# EAGLE design motor_controller-v1.0 (EAGLE 7.6.0)
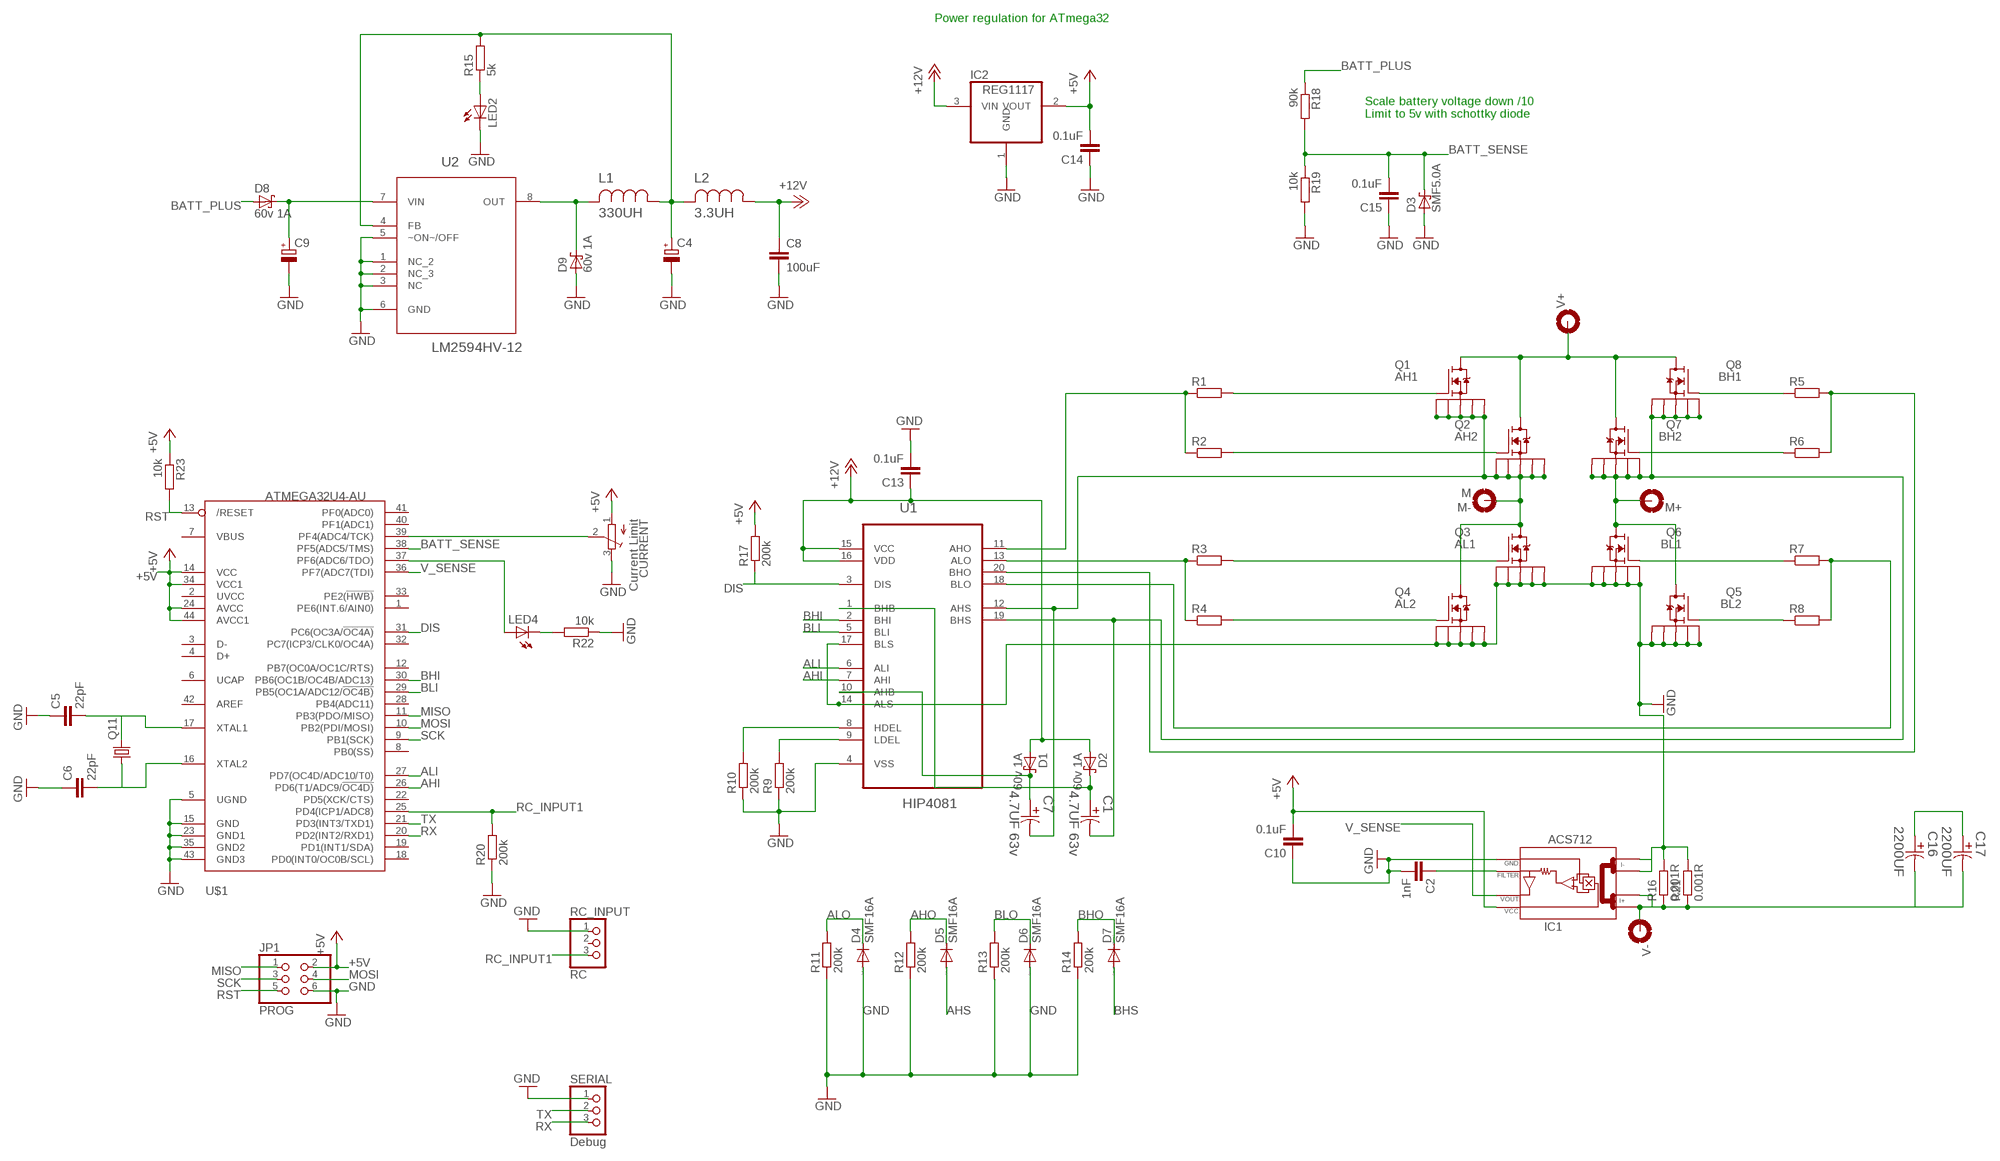
[diagram p0: schematic, sheet 1]

## Parts
C1  4.7UF 63v  EEE-FK1J4R7R-CASE-C  [CAPAE530X610N]
C2  1nF  C-EUC0805  [C0805]
C4  CPOL-EU153CLV-0605  [153CLV-0605]
C5  22pF  C-EUC0805K  [C0805K]
C6  22pF  C-EUC0805K  [C0805K]
C7  4.7UF 63v  EEE-FK1J4R7R-CASE-C  [CAPAE530X610N]
C8  100uF  C-EUC0805  [C0805]
C9  CPOL-EU153CLV-0810  [153CLV-0810]
C10  0.1uF  C-EUC0805  [C0805]
C13  0.1uF  C-EUC0805  [C0805]
C14  0.1uF  C-EUC0805  [C0805]
C15  0.1uF  C-EUC0805  [C0805]
C16  2200UF  ECA1JM222-D18XP7.5  [CAPPR750-1800X4000]
C17  2200UF  ECA1JM222-D18XP7.5  [CAPPR750-1800X4000]
CURRENT  Current Limit  TRIMPOTTC33X  [TC33X]
D1  60v 1A  SMF5.0AT1  [SOD123FL]
D2  60v 1A  SMF5.0AT1  [SOD123FL]
D3  SMF5.0A  SMF5.0AT1  [SOD123FL]
D4  SMF16A  CGRM4001-G  [SOD-123_MINI-SMA]
D5  SMF16A  CGRM4001-G  [SOD-123_MINI-SMA]
D6  SMF16A  CGRM4001-G  [SOD-123_MINI-SMA]
D7  SMF16A  CGRM4001-G  [SOD-123_MINI-SMA]
D8  60v 1A  SMF5.0AT1  [SOD123FL]
D9  60v 1A  SMF5.0AT1  [SOD123FL]
IC1  ACS712  [SO08]
IC2  REG1117  [SOT223]
JP1  PROG  PINHD-2X3  [2X03]
L1  330UH  ELLCTV331M-CTV  [IND_ELLCTV]
L2  3.3UH  ELL3FU3R3N-3FU  [IND_ELL3FU]
LED2  LEDCHIPLED_1206  [CHIPLED_1206]
LED4  LEDCHIPLED_1206  [CHIPLED_1206]
M+  MOUNT-PAD-ROUND3.2  [3,2-PAD]
M-  M  MOUNT-PAD-ROUND3.2  [3,2-PAD]
Q1  AH1  NMOSFET-D2PAK-7  [D2PAK-7]
Q2  AH2  NMOSFET-D2PAK-7  [D2PAK-7]
Q3  AL1  NMOSFET-D2PAK-7  [D2PAK-7]
Q4  AL2  NMOSFET-D2PAK-7  [D2PAK-7]
Q5  BL2  NMOSFET-D2PAK-7  [D2PAK-7]
Q6  BL1  NMOSFET-D2PAK-7  [D2PAK-7]
Q7  BH2  NMOSFET-D2PAK-7  [D2PAK-7]
Q8  BH1  NMOSFET-D2PAK-7  [D2PAK-7]
Q11  CRYSTALQC5CB  [QC5CB-XTAL]
R1  R-EU_M0805  [M0805]
R2  R-EU_M0805  [M0805]
R3  R-EU_M0805  [M0805]
R4  R-EU_M0805  [M0805]
R5  R-EU_M0805  [M0805]
R6  R-EU_M0805  [M0805]
R7  R-EU_M0805  [M0805]
R8  R-EU_M0805  [M0805]
R9  200k  R-EU_M0805  [M0805]
R10  200k  R-EU_M0805  [M0805]
R11  200k  R-EU_M0805  [M0805]
R12  200k  R-EU_M0805  [M0805]
R13  200k  R-EU_M0805  [M0805]
R14  200k  R-EU_M0805  [M0805]
R15  5k  R-EU_M0805  [M0805]
R16  0.001R  R-EU_R2512  [R2512]
R17  200k  R-EU_M0805  [M0805]
R18  90k  R-EU_M0805  [M0805]
R19  10k  R-EU_M0805  [M0805]
R20  200k  R-EU_M0805  [M0805]
R21  0.001R  R-EU_R2512  [R2512]
R22  10k  R-EU_M0805  [M0805]
R23  10k  R-EU_M0805  [M0805]
RC_INPUT  RC  PINHD-1X3  [1X03]
SERIAL  Debug  PINHD-1X3  [1X03]
U1  HIP4081  HIP4081AIBZ  [SOIC127P1032X265-20N]
U2  LM2594HV-12  LM2594M-12  [SOIC127P620X175-8N]
U$1  ATMEGA32U4-AU  [TQFP44]
V+  MOUNT-PAD-ROUND3.2  [3,2-PAD]
V-  MOUNT-PAD-ROUND3.2  [3,2-PAD]

## Nets
+5V: C10.2 C14.2 CURRENT.1(A) IC1.8(VCC) IC2.2(VOUT) JP1.2 R17.2 R23.1 U$1.14(VCC) U$1.24(AVCC) U$1.34(VCC1) U$1.44(AVCC1)
+12V: C8.1 C13.1 D1.A D2.A IC2.3(VIN) L2.1 U1.15(VCC) U1.16(VDD)
AHI: U1.7(AHI) U$1.26(PD6(T1/ADC9/!OC4D))
AHO: D5.C R1.1 R2.1 R12.2 U1.11(AHO)
AHS: C7.2 D5.A M-.B3,2(MOUNT) Q1.S1 Q1.S2 Q1.S3 Q1.S4 Q1.S5 Q2.S1 Q2.S2 Q2.S3 Q2.S4 Q2.S5 Q3.D Q4.D U1.12(AHS)
ALI: U1.6(ALI) U$1.27(PD7(OC4D/ADC10/T0))
ALO: D4.C R3.1 R4.1 R11.2 U1.13(ALO)
BATT_GND: C16.2 C17.2 IC1.1(I+_0) IC1.2(I+_1) R16.1 R21.1 V-.B3,2(MOUNT)
BATT_PLUS: C16.1 C17.1 D8.A Q1.D Q2.D Q7.D Q8.D R18.1 V+.B3,2(MOUNT)
BATT_SENSE: C15.2 D3.C R18.2 R19.1 U$1.38(PF5(ADC5/TMS))
BHI: U1.2(BHI) U$1.30(PB6(OC1B/OC4B/ADC13))
BHO: D7.C R5.2 R6.2 R14.2 U1.20(BHO)
BHS: C1.2 D7.A M+.B3,2(MOUNT) Q5.D Q6.D Q7.S1 Q7.S2 Q7.S3 Q7.S4 Q7.S5 Q8.S1 Q8.S2 Q8.S3 Q8.S4 Q8.S5 U1.19(BHS)
BLI: U1.5(BLI) U$1.29(PB5(OC1A/ADC12/!OC4B))
BLO: D6.C R7.2 R8.2 R13.2 U1.18(BLO)
DIS: R17.1 U1.3(DIS) U$1.31(PC6(OC3A/!OC4A))
GND: C2.2 C4.- C5.1 C6.1 C8.2 C9.- C10.1 C13.2 C14.1 C15.1 CURRENT.3(E) D3.A D4.A D6.A D9.A IC1.3(I-_0) IC1.4(I-_1) IC1.5(GND) IC2.1(GND) JP1.6 LED2.C Q3.S1 Q3.S2 Q3.S3 Q3.S4 Q3.S5 Q4.S1 Q4.S2 Q4.S3 Q4.S4 Q4.S5 Q5.S1 Q5.S2 Q5.S3 Q5.S4 Q5.S5 Q6.S1 Q6.S2 Q6.S3 Q6.S4 Q6.S5 R9.1 R10.1 R11.1 R12.1 R13.1 R14.1 R16.2 R19.2 R20.1 R21.2 R22.1 RC_INPUT.1 SERIAL.1 U1.4(VSS) U1.14(ALS) U1.17(BLS) U2.1(NC_2) U2.2(NC_3) U2.3(NC) U2.5(~ON~/OFF) U2.6(GND) U$1.5(UGND) U$1.15(GND) U$1.23(GND1) U$1.35(GND2) U$1.43(GND3)
MISO: JP1.1 U$1.11(PB3(PDO/MISO))
MOSI: JP1.4 U$1.10(PB2(PDI/MOSI))
N$1: C9.+ D8.C U2.7(VIN)
N$2: C4.+ L1.1 L2.2 R15.2 U2.4(FB)
N$3: Q1.G R1.2
N$4: C2.1 IC1.6(FILTER)
N$5: Q2.G R2.2
N$6: LED4.A U$1.37(PF6(ADC6/TDO))
N$7: Q3.G R3.2
N$8: Q4.G R4.2
N$9: LED2.A R15.1
N$10: D9.C L1.2 U2.8(OUT)
N$11: Q8.G R5.1
N$12: Q7.G R6.1
N$13: Q6.G R7.1
N$14: Q5.G R8.1
N$15: C6.2 Q11.1 U$1.16(XTAL2)
N$16: C5.2 Q11.2 U$1.17(XTAL1)
N$17: CURRENT.2(S) U$1.39(PF4(ADC4/TCK))
N$18: LED4.C R22.2
N$37: R9.2 U1.9(LDEL)
N$38: R10.2 U1.8(HDEL)
N$42: C7.1 D1.C U1.10(AHB)
N$43: C1.1 D2.C U1.1(BHB)
RC_INPUT1: R20.2 RC_INPUT.3 U$1.25(PD4(ICP1/ADC8))
RST: JP1.5 R23.2 U$1.13(/RESET)
RX: SERIAL.3 U$1.20(PD2(INT2/RXD1))
SCK: JP1.3 U$1.9(PB1(SCK))
TX: SERIAL.2 U$1.21(PD3(INT3/TXD1))
V_SENSE: IC1.7(VOUT) U$1.36(PF7(ADC7(TDI))
Unconnected: RC_INPUT.2 U$1.1(PE6(INT.6/AIN0)) U$1.2(UVCC) U$1.3(D-) U$1.4(D+) U$1.6(UCAP) U$1.7(VBUS) U$1.8(PB0(SS)) U$1.12(PB7(OC0A/OC1C/RTS)) U$1.18(PD0(INT0/OC0B/SCL)) U$1.19(PD1(INT1/SDA)) U$1.22(PD5(XCK/CTS)) U$1.28(PB4(ADC11)) U$1.32(PC7(ICP3/CLK0/OC4A)) U$1.33(PE2(!HWB)) U$1.40(PF1(ADC1)) U$1.41(PF0(ADC0)) U$1.42(AREF)

## Notes on the sheet
- Power regulation for ATmega32
- Scale battery voltage down /10
  Limit to 5v with schottky diode

## Library data of the parts
C1 C7 = Panasonic-EEEFK_EEEFP:EEE-: Aluminum Electrolytic Capacitors,Surface Mount Type; MPN: EEE-FK1J4R7R; OC_FARNELL: 9695990; OC_NEWARK: 96K9402; PACKAGE: CASE-C; SUPPLIER: PANASONIC; TOLERANCE: ±20 %; VALUE: 4.7UF; VOLTAGERATING: 63V
C2 C5 C6 C8 C10 C13-C15 = rcl:C-EU: CAPACITOR, European symbol
C4 C9 = rcl:CPOL-EU: POLARIZED CAPACITOR, European symbol
C16 C17 = Panasonic-ECA_00:ECA: Aluminum Electrolytic Capacitors/Radial Lead Type/Series: M/Type: A; MPN: ECA1JM222; OC_FARNELL: 1848515; OC_NEWARK: 17T5022; PACKAGE: Radial Lead-TH; SUPPLIER: PANASONIC; TOLERANCE: ±20 %; VOLTAGERATING: 63V
CURRENT = adafruit:TRIMPOT: SMT trimmer potentiometer part number TC33X http://www.ladyada.net/library/eagle
D1-D3 D8 D9 = diode:SMF5.0AT1: 200 W Transient Voltage Suppressor Source: Data sheet <http://www.onsemi.com/pub_link/Collateral/SMF5.0AT1-D.PDF>
D4-D7 = diode:CGRM400*-G: Molded plasitc,JEDEC SOD-123/Mini SMA Source: Comchip CGRM4001-G.pdf
IC1 = ACS712:ACS712
IC2 = burr-brown:REG1117: 800mA and 1A Low Dropout (LDO) Positive Regulator 1.8V, 2.5V, 2.85V, 3.3V, 5V, and Adj; MPN: REG1117; OC_FARNELL: 1097566; OC_NEWARK: 14P6981
JP1 = pinhead:PINHD-2X3: PIN HEADER
L1 = Panasonic-ELL:ELL: Choke Coils; MPN: ELLCTV331M; OC_FARNELL: 1717539; OC_NEWARK: 15R1008; PACKAGE: 12X12X4.5MM; SUPPLIER: PANASONIC
L2 = Panasonic-ELL:ELL: Choke Coils; CURRENTRATING: 1.16A; MPN: ELL3FU3R3N; OC_FARNELL: 1888689; OC_NEWARK: unknown; PACKAGE: SMD-3FU; SUPPLIER: PANASONIC; TOLERANCE: ±30 %
LED2 LED4 = led:LED: LED OSRAM: - CHIPLED LG R971, LG N971, LY N971, LG Q971, LY Q971, LO R971, LY R971 LH N974, LH R974 LS Q976, LO Q976, LY Q976 LO Q996 - Hyper CHIPLED LW Q18S LB Q993, LB Q99A, LB R99A - SideLED LS A670, LO A670, LY A670, LG A670, LP A670 LB A673, LV A673, LT A673, LW A673 LH A674 LY A675 LS A676, LA A676, LO A676, LY A676, LW A676 LS A679, LY A679, LG A679 - Hyper Micro SIDELED® LS Y876, LA Y876, LO Y876, LY Y876 LT Y87S - SmartLED LW L88C, LW L88S LB L89C, LB L89S, LG L890 LS L89K, LO L89K, LY L89K LS L896, LA L896, LO L896, LY L896 - TOPLED LS T670, LO T670, LY T670, LG T670, LP T670 LSG T670, LSP T670, LSY T670, LOP T670, LYG T670 LG T671, LOG T671, LSG T671 LB T673, LV T673, LT T673, LW T673 LH T674 LS T676, LA T676, LO T676, LY T676, LB T676, LH T676, LSB T676, LW T676 LB T67C, LV T67C, LT T67C, LS T67K, LO T67K, LY T67K, LW E67C LS E67B, LA E67B, LO E67B, LY E67B, LB E67C, LV E67C, LT E67C LW T67C LS T679, LY T679, LG T679 LS T770, LO T770, LY T770, LG T770, LP T770 LB T773, LV T773, LT T773, LW T773 LH T774 LS E675, LA E675, LY E675, LS T675 LS T776, LA T776, LO T776, LY T776, LB T776 LHGB T686 LT T68C, LB T68C - Hyper Mini TOPLED® LB M676 - Mini TOPLED Santana® LG M470 LS M47K, LO M47K, LY M47K Source: http://www.osram.convergy.de LUXEON: - LUMILED® LXK2-PW12-R00, LXK2-PW12-S00, LXK2-PW14-U00, LXK2-PW14-V00 LXK2-PM12-R00, LXK2-PM12-S00, LXK2-PM14-U00 LXK2-PE12-Q00, LXK2-PE12-R00, LXK2-PE12-S00, LXK2-PE14-T00, LXK2-PE14-U00 LXK2-PB12-K00, LXK2-PB12-L00, LXK2-PB12-M00, LXK2-PB14-N00, LXK2-PB14-P00, LXK2-PB14-Q00 LXK2-PR12-L00, LXK2-PR12-M00, LXK2-PR14-Q00, LXK2-PR14-R00 LXK2-PD12-Q00, LXK2-PD12-R00, LXK2-PD12-S00 LXK2-PH12-R00, LXK2-PH12-S00 LXK2-PL12-P00, LXK2-PL12-Q00, LXK2-PL12-R00 Source: www.luxeon.com KINGBRIGHT: KA-3528ASYC Source: www.kingbright.com
M+ M- V+ V- = holes:MOUNT-PAD-ROUND: MOUNTING PAD, round
Q1-Q8 = D2PAK-7:NMOSFET-D2PAK-7
Q11 = andys_parts:CRYSTAL: CRYSTAL
R1-R23 = rcl:R-EU_: RESISTOR, European symbol
RC_INPUT SERIAL = pinhead:PINHD-1X3: PIN HEADER
U1 = Intersil_By_element14_Batch_1:HIP4081AIBZ: 80V/2.5A Peak, High Frequency Full Bridge FET Driver; MPN: HIP4081AIBZ; OC_FARNELL: 1561934; OC_NEWARK: 57K3816; PACKAGE: SOIC-20; SUPPLIER: Intersil
U2 = andys_parts:LM2594M-12: SIMPLE SWITCHER; MPN: LM2594M-12; OC_FARNELL: 1850240; OC_NEWARK: 41K3820; PACKAGE: SOIC-8; SUPPLIER: National Semiconductor
U$1 = adafruit:ATMEGA32U4: http://www.ladyada.net/library/eagle

## Board
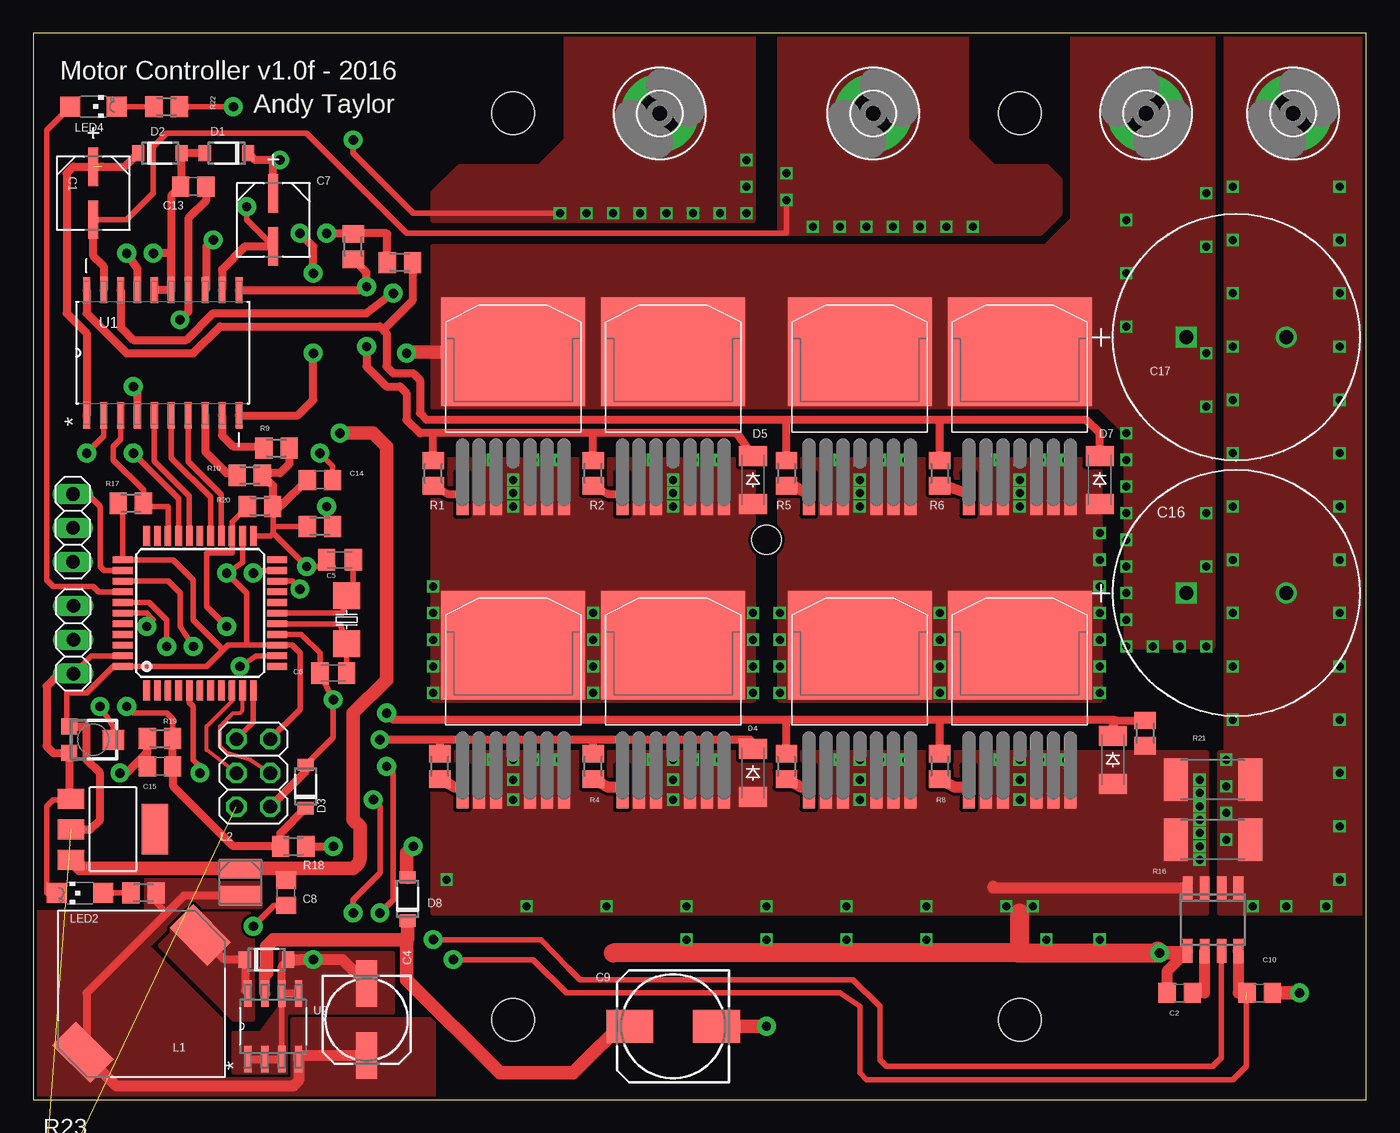
[diagram p1: board, top side]
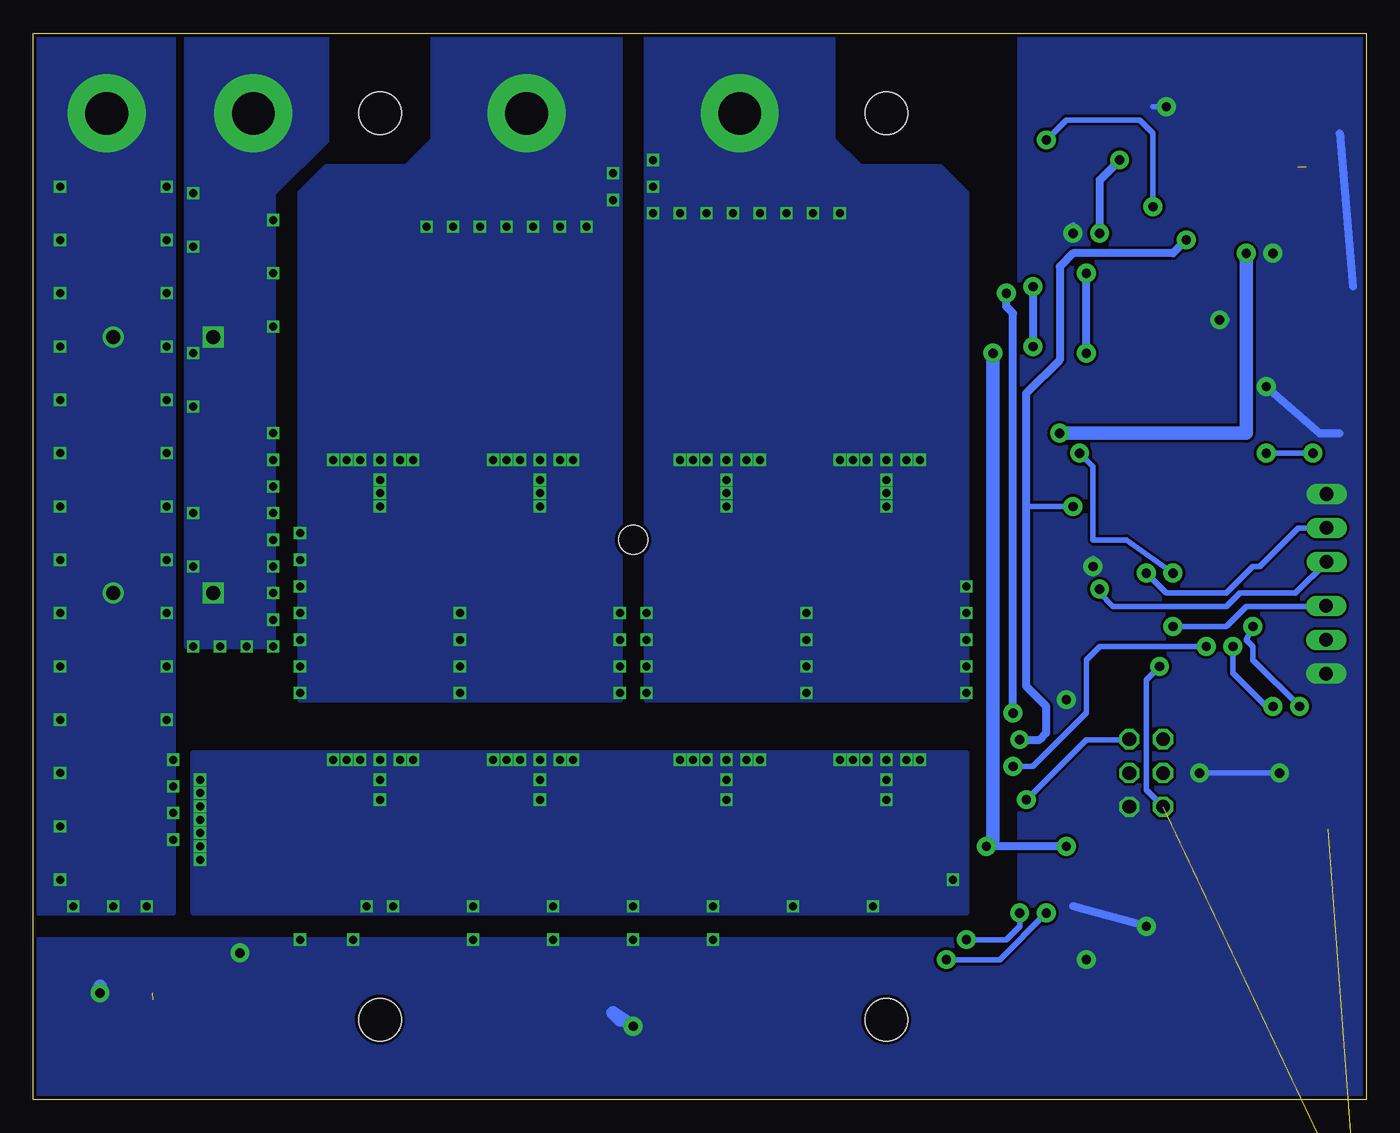
[diagram p2: board, bottom side, seen from below]

Size 100 x 80 mm. Coordinates in mm from the lower left corner, seen from the top.
Outline: 0,0 100,0 100,80 0,80 0,0
Copper layers (1*16): Top 0.035mm / dielectric 1.5mm / Bottom 0.035mm
Design rules "dirt_cheap_dirty_boards.v1 *": minimum track width 5mil, minimum drill 12mil, track to track 8mil, track to pad 8mil, pad to pad 8mil, via to via 8mil, smd to smd 0mil, copper to edge 10mil, drill to drill 10mil, minimum pad ring 10mil, minimum via ring 6mil, stop-mask expansion 2mil, vias tented up to drill 25mil, thermal gap 10mil
Holes 3.2 mm at 74,74 74,6 36,74 36,6
Holes 2.2 mm at 55,42

### Footprints (pad centres in the part's own frame; a part is rotated, then mirrored left to right if it is on the bottom)
CAPAE530X610N = smd 2.87 x 0.762: 1 -1.981,0; 2 1.981,0
C0805 = smd 1.3 x 1.5: 1 -0.95,0; 2 0.95,0
153CLV-0605 = smd 3.5 x 1.6: + 2.7,0; - -2.7,0
C0805K = smd 1.3 x 1.6: 1 -1,0; 2 1,0
153CLV-0810 = smd 3.5 x 2.5: + 3.25,0; - -3.25,0
CAPPR750-1800X4000 = drill 1.041 square: 1 -7.493,0 | drill 1.041: 2 0,0
TC33X = smd 1.2 x 1.2: 1 -1,-1.825; 3 1,-1.825 | smd 1.5 x 1.6: 2 0,1.5
SOD123FL = smd 0.91 x 1.22: A 1.625,0; C -1.625,0
SOD-123_MINI-SMA = smd 1.5 x 2.1: A 1.8,0; C -1.8,0
SO08 = smd 0.72 x 1.78: 1 -1.905,-2.35; 2 -0.635,-2.35; 3 0.635,-2.35; 4 1.905,-2.35; 5 1.905,2.35; 6 0.635,2.35; 7 -0.635,2.35; 8 -1.905,2.35
SOT223 = smd 1.499 x 2.007: 1 -2.261,-3.15; 2 0.025,-3.15; 3 2.311,-3.15 | smd 3.81 x 2.007: 4 0,3.15
2X03 = drill 1.016 octagon: 1 -2.54,-1.27; 2 -2.54,1.27; 3 0,-1.27; 4 0,1.27; 5 2.54,-1.27; 6 2.54,1.27
IND_ELLCTV = smd 2.5 x 4 rotated 45: 1 -4.4,-4.4; 2 4.4,4.4
IND_ELL3FU = smd 1.448 x 3.2: 1 -1.016,0; 2 1.016,0
CHIPLED_1206 = smd 1.5 x 1.5: A 0,-1.75; C 0,1.75
3,2-PAD = drill 3.2 pad 5.842: B3,2 0,0
D2PAK-7 = smd 10.8 x 8.15: D 0,4.1 | smd 0.9 x 3.2: G -3.81,-6.56; S1 -2.54,-6.56; S2 -1.27,-6.56; S3 1.27,-6.56; S4 2.54,-6.56; S5 3.81,-6.56
QC5CB-XTAL = smd 2 x 2: 1 -1.8,0; 2 1.8,0
M0805 = smd 1.3 x 1.6: 1 -0.95,0; 2 0.95,0
R2512 = smd 1.8 x 3.2: 1 -2.8,0; 2 2.8,0
1X03 = drill 1.016 long: 1 -2.54,0; 2 0,0; 3 2.54,0
SOIC127P1032X265-20N = smd 1.981 x 0.533: 1 -4.699,5.715; 2 -4.699,4.445; 3 -4.699,3.175; 4 -4.699,1.905; 5 -4.699,0.635; 6 -4.699,-0.635; 7 -4.699,-1.905; 8 -4.699,-3.175; 9 -4.699,-4.445; 10 -4.699,-5.715; 11 4.699,-5.715; 12 4.699,-4.445; 13 4.699,-3.175; 14 4.699,-1.905; 15 4.699,-0.635; 16 4.699,0.635; 17 4.699,1.905; 18 4.699,3.175; 19 4.699,4.445; 20 4.699,5.715
SOIC127P620X175-8N = smd 1.981 x 0.559: 1 -2.464,1.905; 2 -2.464,0.635; 3 -2.464,-0.635; 4 -2.464,-1.905; 5 2.464,-1.905; 6 2.464,-0.635; 7 2.464,0.635; 8 2.464,1.905
TQFP44 = smd 1.5 x 0.5: 1 -5.8,4; 2 -5.8,3.2; 3 -5.8,2.4; 4 -5.8,1.6; 5 -5.8,0.8; 6 -5.8,0; 7 -5.8,-0.8; 8 -5.8,-1.6; 9 -5.8,-2.4; 10 -5.8,-3.2; 11 -5.8,-4; 23 5.8,-4; 24 5.8,-3.2; 25 5.8,-2.4; 26 5.8,-1.6; 27 5.8,-0.8; 28 5.8,0; 29 5.8,0.8; 30 5.8,1.6; 31 5.8,2.4; 32 5.8,3.2; 33 5.8,4 | smd 0.5 x 1.5: 12 -4,-5.8; 13 -3.2,-5.8; 14 -2.4,-5.8; 15 -1.6,-5.8; 16 -0.8,-5.8; 17 0,-5.8; 18 0.8,-5.8; 19 1.6,-5.8; 20 2.4,-5.8; 21 3.2,-5.8; 22 4,-5.8; 34 4,5.8; 35 3.2,5.8; 36 2.4,5.8; 37 1.6,5.8; 38 0.8,5.8; 39 0,5.8; 40 -0.8,5.8; 41 -1.6,5.8; 42 -2.4,5.8; 43 -3.2,5.8; 44 -4,5.8

### Placement (x,y rotation side)
C1  4.5,68 270 top
C2  86,8 180 top
C4  25,6 270 top
C5  23,40.5 0 top
C6  22.5,32 0 top
C7  18,66 270 top
C8  18.96,15.52 270 top
C9  48,5.5 180 top
C10  92,8 180 top
C13  12,68.5 0 top
C14  21.5,46.5 0 top
C15  9.5,25 0 top
C16  94,38 0 top
C17  94,57.2 0 top
CURRENT  4.5,27 270 top
D1  14.5,71 180 top
D2  9.5,71 0 top
D3  20.43,23.49 90 top
D4  54,24.5 270 top
D5  54,46.5 270 top
D6  81,25.5 270 top
D7  80,46.5 270 top
D8  28.07,15.05 90 top
D9  17.5,10.5 0 top
IC1  88.5,13.5 180 top
IC2  5.98,20.28 270 top
JP1  16.5,24.5 270 top
L1  8.12,7.94 0 top
L2  15.54,16.31 270 top
LED2  3.5,15.5 90 top
LED4  4.5,74.5 270 top
M+  63,74 0 top
M-  47,74 0 top
Q1  36,52 0 top
Q2  48,52 0 top
Q3  36,30 0 top
Q4  48,30 0 top
Q5  74,30 0 top
Q6  62,30 0 top
Q7  74,52 0 top
Q8  62,52 0 top
Q11  23.5,36 90 top
R1  30,47 270 top
R2  42,47 270 top
R3  30.5,25 270 top
R4  42,25 270 top
R5  56.5,47 90 top
R6  68,47 90 top
R7  56.5,25 90 top
R8  68,25 90 top
R9  18.25,48.88 180 top
R10  16.25,46.84 180 top
R11  21.5,43 0 top
R12  24,64 270 top
R13  83.4,27.5 90 top
R14  27.5,62.8 0 top
R15  8.27,15.51 0 top
R16  88.5,19.5 180 top
R17  7.32,44.75 180 top
R18  19.5,19 180 top
R19  9.5,27.1 180 top
R20  17,44.5 180 top
R21  88.5,24 180 top
R22  10,74.5 180 top
R23  2,-4 0 top  (outside the outline)
RC_INPUT  3,34.5 90 top
SERIAL  2.96,42.89 270 top
U1  9.72,56.03 90 top
U2  18,5.5 90 top
U$1  12.5,36.5 90 top
V+  83.5,74 90 top
V-  94.5,74 0 top

### Tracks (layer width: path | path; a pad name or v marks a point on that pad's centre or on a via)
+5V  (via drill 0.7 pad 1.42)  (2 unrouted)
  Top 0.406: 4,28 3.5,28 | R17.2 6.7,44.42 U$1.34 10.5,40.5 12,39 12,36 14.25,33.75 | JP1.2 20,29.27 20,33.5 19.4,34.1 U$1.14 16,34.1 | v24,14 24,15 26,17 26,22 v25.5,22.5 | v31.5,10.5 34,10.5 37.5,10.5 40,8 41.5,8 60.5,8 62,7 62,2 62.5,1.5 90,1.5 91,2.5 91,7.5 | 14.25,33.75 13,32.5 U$1.44 6,32.5 4,30.5 2.5,30.5 2.5,28 CURRENT.1 | 14.25,33.75 14.6,34.1 16,34.1 | C14.2 22.45,47.55 v21.5,48.5 | U$1.24 15.7,40.3 v14.5,39.5 16,38 16,34.1
  Top 0.61: IC2.2 4.26,20.26 5,21 5,24.5 4,25.5 4,28 CURRENT.1
  Top 0.813: IC1.8 90.41,8 C10.2
  Bottom 0.406: v31.5,10.5 27.5,10.5 v24,14 | v25.5,22.5 21,27 17.81,27 JP1.2 | v21.5,48.5 20.5,47.5 20.5,42 18,42 v14.5,39.5
+12V  (via drill 0.7 pad 1.42)
  Top 0.61: U1.15 U1.16 | D1.A D2.A 11.12,68.58 C13.1 10.36,67.81 U1.15 | U1.15 10.36,63.5 v9,63.5
  Top 1.016: IC2.3 3.47,17.33 L2.1 19,17.33 | 19,17.33 24,17.33 24.31,17.64 arc45 24.5,18.09 24.5,20.5 24,21 24,29 26.5,31.5 26.5,49 25.5,50 v23,50 | C8.1 19,16.47 19,17.33
  Bottom 1.016: v9,63.5 9,50 v23,50
AHI
  Top 0.406: U$1.26 14.1,45.4 11.62,47.88 U1.7
AHO  (via drill 0.7 pad 1.42)
  Top 0.61: D5.C 52.8,50 42,50 | 42,50 30,50 | R1.1 30,50 | R2.1 42,50 | 30,50 29,50 28,51 28,53 27.5,53.5 26.5,53.5 25,55 v25,56.5 | U1.11 24.73,60.73 v25,61 25,62.05 R12.2
  Bottom 0.406: v25,56.5 25,57
  Bottom 0.61: v25,61 25,57
AHS  (via drill 0.6 pad 0.25, 0.7 pad 1.42)
  Top 0.406: C7.2 16,66.02 v16,67 | v24,72 24,71 28.5,66.5 v39.5,66.5
  Top 0.61: U1.12 14.16,62.27 15.91,64.02 C7.2
  Bottom 0.406: v16,67 16,72.5 17,73.5 22.5,73.5 v24,72
  other vias: 36,45.5 36,44.5 36,48 37.5,48 38.5,48 39.5,48 34.5,48 33.5,48 36,46.5 48,46.5 48,45.5 48,44.5 48,48 46.5,48 45.5,48 49.5,48 50.5,48 51.5,48 42,30.5 42,32.5 42,34.5 42,36.5 54,30.5 54,32.5 54,34.5 54,36.5 30,30.5 30,32.5 30,34.5 30,36.5 30,38.5 53.5,68.5 53.5,70.5 53.5,66.5 51.5,66.5 49.5,66.5 47.5,66.5 45.5,66.5 43.5,66.5 41.5,66.5
  pour Top (isolate 0.254, no thermals): 30,30 54,30 54,48 30,48
  pour Bottom (no thermals): 30,30 54,30 54,80 40,80 40,72 38,70 32,70 30,68
  pour Top (no thermals): 54,80 54,66 30,66 30,68 32,70 38,70 40,72 40,80
ALI
  Top 0.406: U$1.27 13.3,45.2 10.36,48.15 U1.6
ALO  (via drill 0.7 pad 1.42)
  Top 0.406: R11.2 22,43.45 v22,44.5
  Top 0.61: D4.C 53.8,27 42,27 | 42,27 30.5,27 | R3.1 30.5,27 | R4.1 42,27 | U1.13 13,60.83 13,64 v13.5,64.5 | 30.5,27 v26,27
  Bottom 0.406: v22,44.5 25.5,44.5
  Bottom 0.61: v13.5,64.5 14.5,63.5 22,63.5 23,62.5 23,55.5 25.5,53 25.5,44.5 25.5,31 24,29.5 24,27.5 24.5,27 v26,27
BATT_GND  (via drill 0.6 pad 0.25)
  other vias: 89.5,25.5 89.5,23.5 89.5,21.5 89.5,19.5 91.5,14.5 94,14.5 90,40.5 90,44.5 90,48.5 90,36.5 90,32.5 90,52.5 90,56.5 90,60.5 90,64.5 90,68.5 98,68.5 98,64.5 98,60.5 98,56.5 98,52.5 98,48.5 98,44.5 98,40.5 98,36.5 98,32.5 98,28.5 98,24.5 98,20.5 98,16.5 97,14.5 90,28.5
  pour Bottom (no thermals): 100,80 89.5,80 89.5,14 100,14
  pour Top (no thermals): 89.5,80 100,80 100,14 89,14 89,26 89.5,26
BATT_PLUS  (via drill 0.6 pad 0.25, 0.7 pad 1.42)
  Top 0.61: 28.1,56.1 v28,56 | R18.1 v22.5,19
  Top 1.016: Q1.D 28.1,56.1 | v28.5,19 28,18.5 28,16.75 D8.A
  Bottom 0.61: v22.5,19 v28.5,19
  Bottom 1.016: v28,56 28,19.5 v28.5,19
  other vias: 82,50 82,48 82,46 82,44 82,42 82,40 82,38 82,36 82,34 84,34 86,34 88,34 88,52 88,56 88,64 88,68 88,44 88,40 82,66 82,62 82,58
  pour Top (no thermals): 88.5,80 88.5,34 82,34 82,50 80,52 30,52 30,64 76,64 78,66 78,80
  pour Bottom (no thermals): 82,34 88.5,34 88.5,80 78,80 78,72 82,68
BATT_SENSE  (via drill 0.7 pad 1.42)
  Top 0.406: R19.1 10.45,28.55 10,29 7.5,29 v7,29.5 | v10,34 10,36 8.7,37.3 U$1.38
  Top 0.61: R19.1 C15.2 10.5,24.95 10.5,23.5 15,19 R18.2 18.55,19.99 D3.C
  Bottom 0.406: v7,29.5 7.5,29.5 10,32 v10,34
BHI  (via drill 0.7 pad 1.42)
  Top 0.406: U$1.30 10.9,45.1 v7.5,48.5 | v4,48.5 5.28,49.77 U1.2
  Bottom 0.406: v7.5,48.5 v4,48.5
BHO
  Top 0.61: D7.C 80,50 79,51 68,51 | 68,51 56.5,51 | 56.5,51 29.5,51 29,51.5 29,54 28.5,54.5 27,54.5 26.5,55 26.5,57.5 26.25,57.75 | R5.2 56.5,51 | R6.2 68,51 | U1.20 4,59 7,56 12,56 14,58 26,58 26.25,57.75 | R14.2 28.45,59.95 26.25,57.75
BHS  (via drill 0.6 pad 0.25)
  Top 0.406: v56.5,67.5 56.5,65 28,65 20.5,72.5 10,72.5 9,71.5 9,68 7.02,66.02 C1.2
  Top 0.61: U1.19 5.28,62.52 4.5,63.3 C1.2
  other vias: 62,48 62,45.5 62,44.5 62,46.5 60.5,48 59.5,48 63.5,48 64.5,48 65.5,48 74,46.5 74,45.5 74,44.5 74,48 75.5,48 76.5,48 77.5,48 72.5,48 71.5,48 68,30.5 68,32.5 68,34.5 68,36.5 80,30.5 80,32.5 80,34.5 80,36.5 56,36.5 56,34.5 56,32.5 56,30.5 80,38.5 80,40.5 80,42.5 58.5,65.5 56.5,69.5 60.5,65.5 62.5,65.5 64.5,65.5 66.5,65.5 68.5,65.5 70.5,65.5
  pour Top (isolate 0.254, no thermals): 56,30 56,48 80,48 80,30
  pour Bottom (no thermals): 56,80 56,30 80,30 80,68 78,70 72,70 70,72 70,80
  pour Top (no thermals): 56,80 56,65 75.5,65 77,66.5 77,69 76,70 72,70 70,72 70,80
BLI
  Top 0.406: U1.5 9.09,47.91 11.7,45.3 U$1.29
BLO  (via drill 0.7 pad 1.42)
  Top 0.61: 68,28.5 81,28.5 D6.C 81.15,28.45 R13.2 | 68,28.5 56.5,28.5 | 56.5,28.5 27,28.5 v26.5,29 | R7.2 56.5,28.5 | R8.2 68,28.5 | U1.18 6.54,57.95 7.5,57 11.5,57 13.5,59 25,59 v27,60.5
  Bottom 0.61: v26.5,29 26.5,59 27,59.5 v27,60.5
DIS
  Top 0.406: U1.3 6.54,49.55 6,49 6,48 8.27,45.73 R17.1 8.52,44.5 10.1,44.5 U$1.31
GND  (via drill 0.6 pad 0.25, 0.7 pad 1.42)
  Top 0.406: U$1.43 4.34,33.3 RC_INPUT.1 | SERIAL.1 4.07,45.43 5,44.5 5,40 5.3,39.7 U$1.35 | IC2.1 2.79,22.5 1.5,22.5 1,22 1,15.5 LED2.C 1.75,15.69 | U$1.23 17.8,42.3 18,42.5 | 18,42.5 18,43 | 18,43 18,44 18,44.45 R20.1 | 18,42.5 v20.5,40 22.5,40 C5.1 | U$1.5 11.7,29.8 12,29.5 12,25.5 12.5,25 v12.5,24.5 | C8.2 18.07,14.57 v16.5,13 | R11.1 18,43 | D3.A 22.5,27.19 v22.5,30 C6.1 21.5,33.5 20.1,34.9 U$1.15 | U2.3 U2.6 | 20,10.5 v21,10.5 | R22.1 v15,74.5
  Top 0.61: C13.2 12.95,67.45 11.62,66.12 U1.14 11.62,59.12 v11,58.5 | IC2.1 2.67,22.7 CURRENT.3 1.5,26 1,26.5 1,31 1.96,31.96 RC_INPUT.1 | C15.1 R19.2 8.55,26.05 7,24.5 v6.5,24.5 | U2.1 U2.2 U2.3 | U2.5 U2.6 18.64,10.01 D9.A | U1.17 7.82,62.31 v7,63.5 | D3.A 20.43,24.62 JP1.6 | U1.4 7.82,53.5 v7.5,53.5 | R9.1 19.2,47.7 18.5,47 17.36,47 R10.1 18,46.03 18,44.45 | C14.1 18.55,44.55 18,44 | R14.1 26.55,64.95 26.5,65 24.05,65 R12.1 22.05,64.95 v22,65
  Top 0.813: D9.A 20,10.5 23.2,10.5 C4.- | IC1.5 86.44,11 85.05,9.61 C2.2 | IC1.4 72,15.85 72,16
  Top 1.016: C10.1 v95,8 | 86.44,11 v84.5,11 | C9.- v55,5.5
  Top 1.422: 74,14 74,11.15 73.85,11 | 84.35,11.15 v84.5,11 73.85,11 | 73.85,11 43.5,11
  Bottom 0.406: v12.5,24.5 7,24.5 | v21,10.5 21.5,10.5 | v15,74.5 16,74.5
  Bottom 0.61: v16.5,13 22,14.5 | v11,58.5 10.5,58.5 | v20.5,40 20.5,40.5 | v7.5,53.5 3.5,50 2,50 | v22,65 22,65.5 | 2,72.5 1,61
  Bottom 1.016: v95,8 95,8.5 | v55,5.5 56.5,6.5 56,6
  other vias: 36,22.5 36,24 36,25.5 34.5,25.5 33.5,25.5 37.5,25.5 38.5,25.5 39.5,25.5 45.5,25.5 46.5,25.5 48,25.5 48,24 48,22.5 49.5,25.5 50.5,25.5 51.5,25.5 59.5,25.5 60.5,25.5 62,25.5 62,24 62,22.5 63.5,25.5 64.5,25.5 65.5,25.5 71.5,25.5 72.5,25.5 74,25.5 75.5,25.5 76.5,25.5 77.5,25.5 74,24 74,22.5 87.5,18 87.5,19 87.5,20 87.5,21 87.5,22 87.5,23 87.5,24 75,14.5 73,14.5 76,12 80,12 67,14.5 61,14.5 55,14.5 49,14.5 43,14.5 37,14.5 31,16.5 67,12 61,12 55,12 49,12
  pour Top (isolate 0.254, no thermals): 30,26 88,26 88,14 30,14
  pour Bottom (no thermals): 30,26 30,14 88,14 88,26
  pour Bottom (no thermals): 100,0 0,0 0,80 26,80 26,12 100,12
  pour Top (rank 2, no thermals): 15,2 19,2 19,6.5 27,6.5 27,11 18.5,11 18.5,7 17,5 15,5
MISO
  Top 0.406: JP1.1 16.5,28.31 U$1.11
MOSI
  Top 0.305: JP1.4 16.27,25.5 14.5,26 14,26.5 14,28 15,29 15.5,29 15.7,29.2 U$1.10
N$1
  Top 0.813: U2.7 17.36,9.87 17.5,10
  Top 1.016: D8.C 28.07,12.07 28,12 | 28,12 18,12 17.5,11.5 17.5,10 17.5,9.5 | 28,12 28,9 35,2 40.5,2 44.75,6.25 C9.+
N$2
  Top 0.406: R15.2 8.72,15.28 10,14
  Top 0.61: L1.1 4,3.82 4,8 10,14 11.29,15.29 L2.2
  Top 0.813: L1.1 6.26,1 19.5,1 19.91,1.41 U2.4 19.91,3.3 C4.+
  pour Top (no thermals): 0,0 30,0 30,6 19.5,6 19.5,1.5 14,1.5 14,6 8.5,11.5 11.5,14.5 17,14.5 17,16.5 8.5,16.5 8.5,14 0,14
N$3
  Top 0.61: R1.2 31.11,45.44 Q1.G
N$4
  Top 0.813: IC1.6 87.86,8 C2.1
N$5
  Top 0.61: R2.2 43.11,45.44 Q2.G
N$6
  Top 0.406: U$1.37 4.9,38.1 4.5,38.5 1.5,38.5 1,39 1,72.75 LED4.A
N$7
  Top 0.813: R3.2 31.61,23.44 Q3.G
N$8
  Top 0.813: R4.2 43.11,23.44 Q4.G
N$9
  Top 0.406: LED2.A R15.1
N$10
  Top 0.61: U2.8 15.88,8.18 D9.C 14.36,10.5 L1.2
  pour Top (rank 3, no thermals): 16.5,6 15,6 9,12 12,15 16.5,15
N$11
  Top 0.406: R5.1 57.08,46.05
  Top 0.813: 57.08,46.05 Q8.G
N$12
  Top 0.813: R6.1 68.58,46.05 Q7.G
N$13
  Top 0.813: R7.1 57.61,23.44 Q6.G
N$14
  Top 0.813: R8.1 69.11,23.44 Q5.G
N$15
  Top 0.406: U$1.16 23,35.7 Q11.1 C6.2
N$16
  Top 0.406: U$1.17 23.2,36.5 Q11.2 24,38.3 C5.2
N$17  (via drill 0.7 pad 1.42)
  Top 0.406: CURRENT.2 6,28 v5,29.5 | v8.5,35.5 9,36 8.5,36.5 U$1.39
  Bottom 0.406: v5,29.5 8.5,33 8.5,34 9,34.5 v8.5,35.5
N$18
  Top 0.406: LED4.C R22.2
N$37
  Top 0.61: U1.9 14.16,49.84 15,49 17.18,49 R9.2
N$38
  Top 0.61: U1.8 12.89,48.6 14.5,47 15.13,47 R10.2
N$42  (via drill 0.7 pad 1.42)
  Top 0.61: U1.10 19.83,51.33 21,52.5 v21,56 | v21,62 21,64 v20,65 | v18.5,70.5 18,70.5 | 18,70.5 16.62,70.5 D1.C | C7.1 18,70.5
  Bottom 0.61: v21,56 v21,62 | v20,65 20,69 v18.5,70.5
N$43  (1 unrouted)
  Top 0.61: 5.15,70 3,70 2.5,69.5 2.5,59 4,57.49 U1.1 | 7.22,70.34 D2.C 6.86,69.98 C1.1
RC_INPUT1  (via drill 0.7 pad 1.42)
  Top 0.406: R20.2 14.9,43.35 U$1.25 14.9,41 13,41 13,37 v14.5,35.5
  Bottom 0.406: RC_INPUT.3 3.04,37 9,37 10.5,35.5 v14.5,35.5
RST  (via drill 0.7 pad 1.42)  (1 unrouted)
  Top 0.406: U$1.13 16.7,33.3 v15.5,32.5
  Bottom 0.406: v15.5,32.5 16.5,31.5 16.5,23.23 JP1.5
RX  (via drill 0.7 pad 1.42)
  Top 0.406: 20.3,38.3 v20,38.3 19.4,38.9 U$1.20
  Bottom 0.406: SERIAL.3 5.31,38 9.5,38 10.5,37 19,37 20,38 v20,38.3
SCK
  Top 0.305: JP1.3 13,26.23 13,28 14.9,29.9 U$1.9
TX  (via drill 0.7 pad 1.42)
  Top 0.406: v16.5,39.5 16.7,39.7 U$1.21
  Bottom 0.406: SERIAL.2 5.11,42.89 8,40 8.5,40 10.5,38 15,38 v16.5,39.5
V_SENSE  (via drill 0.7 pad 1.42)
  Top 0.406: U$1.36 10.1,38.9 11,38 11,35.5 v12,34 | v30,12 38.1,12 40.1,9.9 41,9 61.5,9 63.5,7 63.5,3 64,2.5 88.5,2.5 89.14,3.13 IC1.7 | v26,14 27,15 27,24.5 v26.5,25
  Bottom 0.406: v30,12 27,12 26,13 v26,14 | v26.5,25 25,25 21,29 21,33 20,34 v12,34

### Text on the board
tNames: Motor Controller v1.0f - 2016 | Andy Taylor
tValues: 0v | 12-50v | M- | M+